# EAGLE design Power-Resistor-Breakout-3W-v001 (EAGLE 6.2)
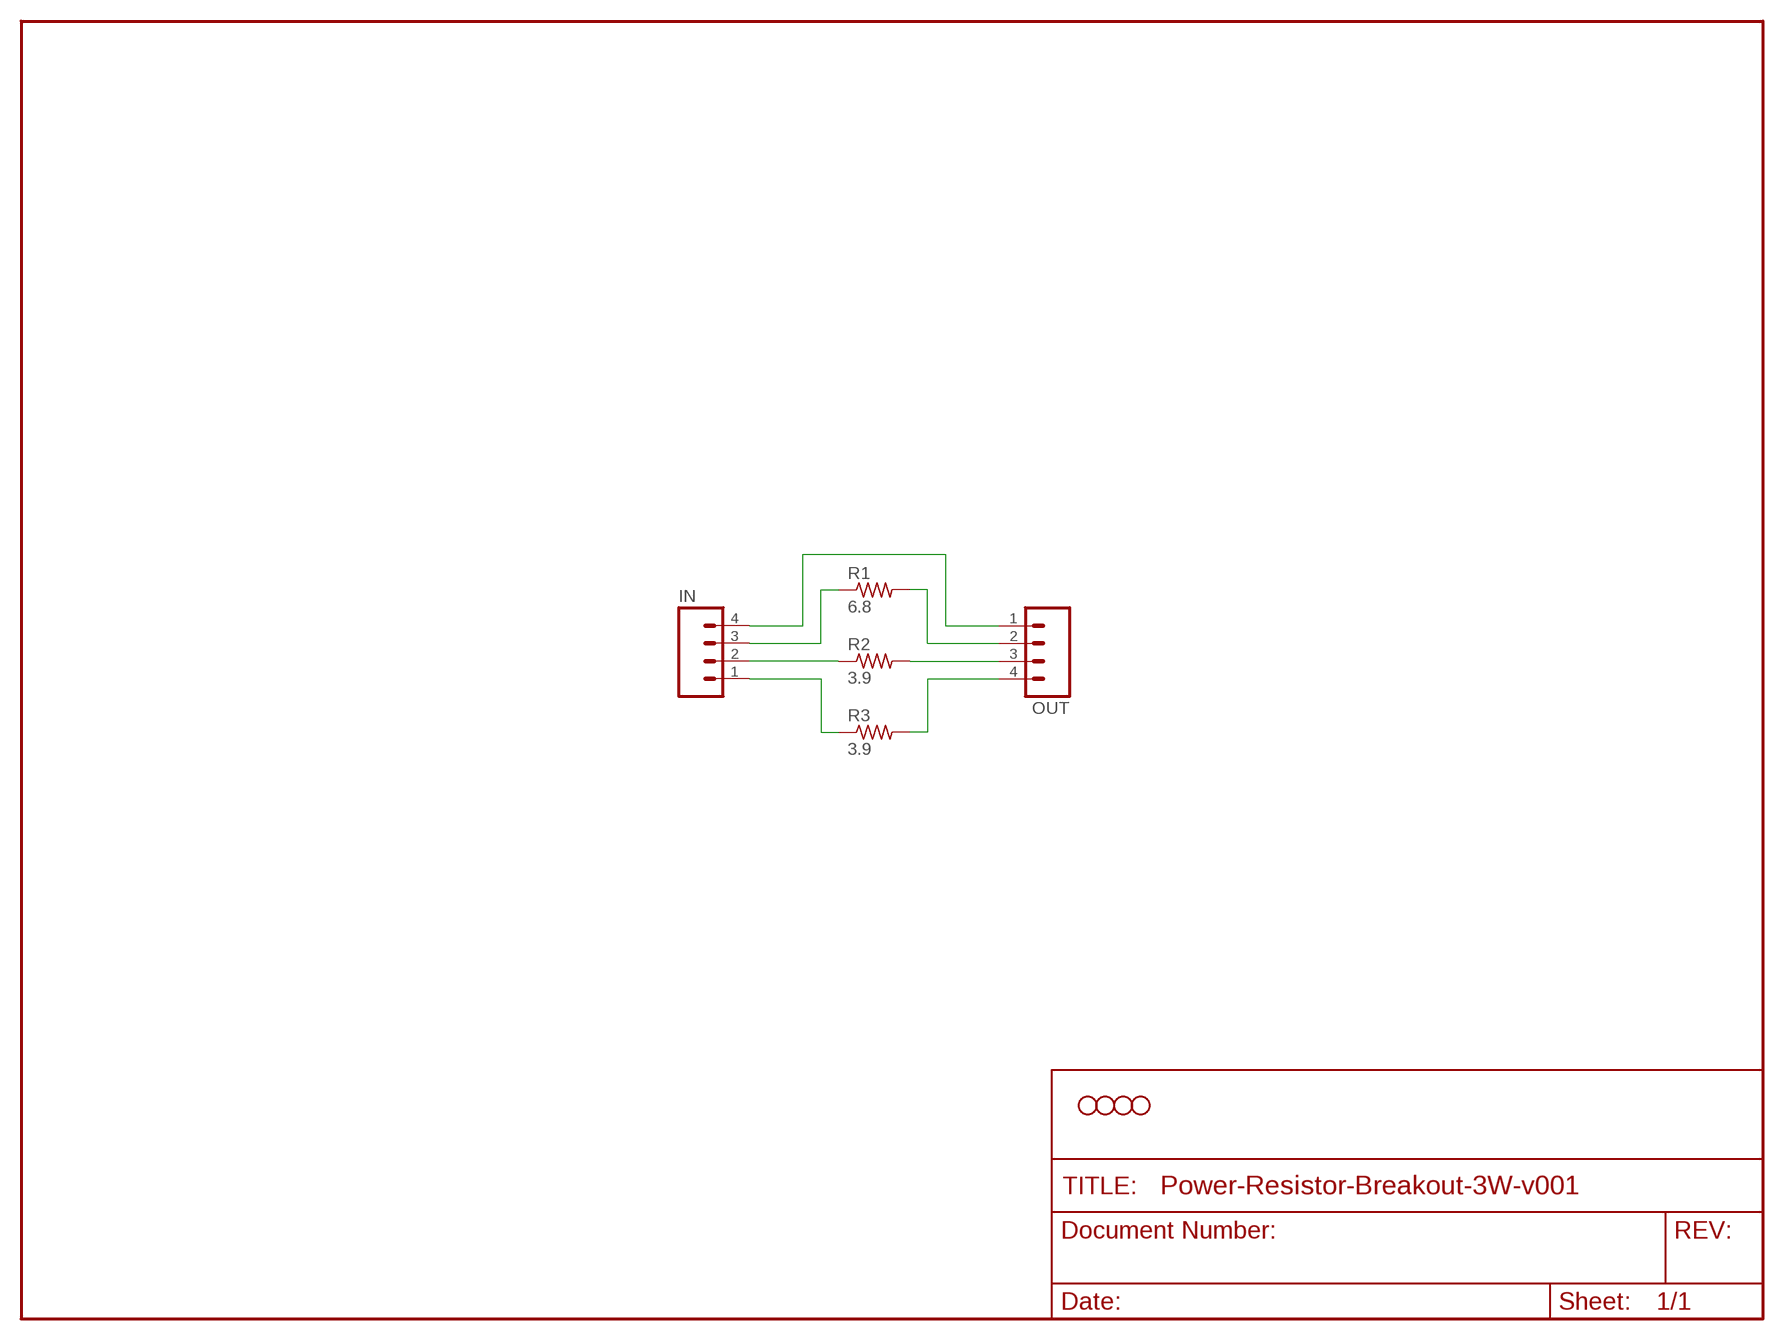
[diagram p0: schematic, sheet 1]

## Parts
IN  M04PTH  [1X04]
JP1  STAND-OFF  [STAND-OFF]
JP2  STAND-OFF  [STAND-OFF]
JP3  STAND-OFF  [STAND-OFF]
JP4  STAND-OFF  [STAND-OFF]
OUT  M04PTH  [1X04]
R1  6.8  R-US_0411/15  [0411/15]
R2  3.9  R-US_0411/15  [0411/15]
R3  3.9  R-US_0411/15  [0411/15]

## Nets
N$1: IN.2 R2.1
N$2: OUT.3 R2.2
N$3: IN.3 R1.1
N$4: IN.1 R3.1
N$5: OUT.4 R3.2
N$6: OUT.2 R1.2
N$7: IN.4 OUT.1

## Library data of the parts
IN OUT = SparkFun:M04: Header 4 Standard 4-pin 0.1" header. Use with straight break away headers (SKU : PRT-00116), right angle break away headers (PRT-00553), swiss pins (PRT-00743), machine pins (PRT-00117), and female headers (PRT-00115). Molex polarized connector foot print use with SKU : PRT-08231 with associated crimp pins and housings. 1MM SMD Version SKU: PRT-10208
JP1-JP4 = SparkFun:STAND-OFF: Stand Off This is the mechanical footprint for a #4 phillips button head screw. Use the keepout ring to avoid running the screw head into surrounding components. SKU : PRT-00447
R1-R3 = resistor:R-US_: RESISTOR, American symbol

## Board
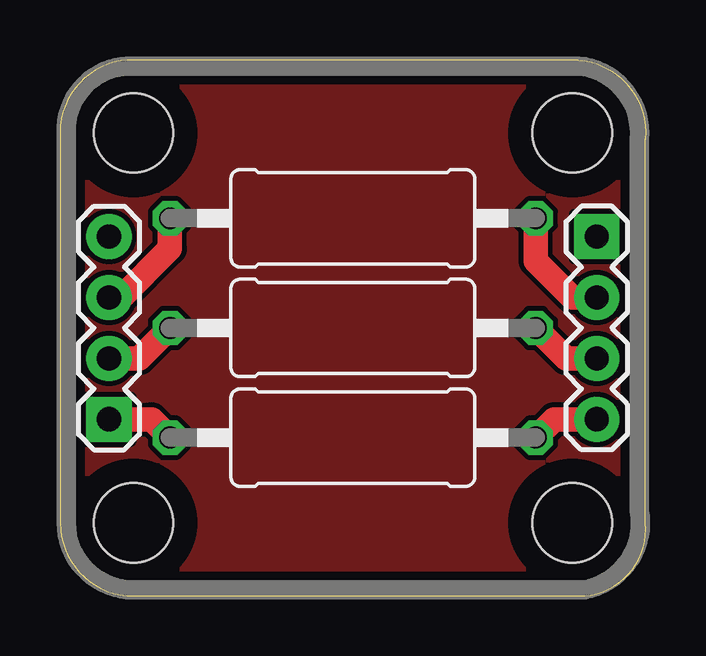
[diagram p1: board, top side]
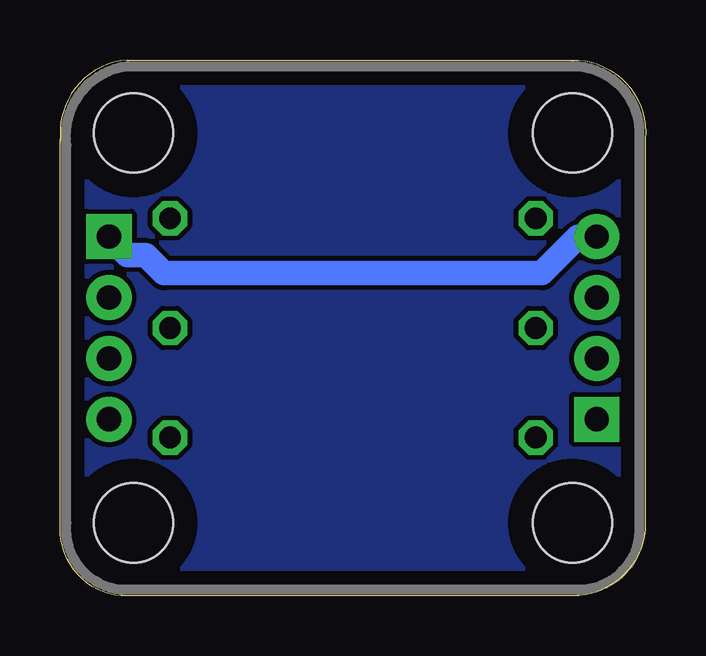
[diagram p2: board, bottom side, seen from below]

Size 24.41 x 22.35 mm. Coordinates in mm from the lower left corner, seen from the top.
Outline: 3.06,0 21.85,0 arc90 24.39,3.05 24.39,19.05 arc90 21.6,22.35 2.8,22.35 arc90 0.01,19.05 0.01,3.05 arc90 3.06,0
Copper layers (1*16): Top 0.035mm / dielectric 1.5mm / Bottom 0.035mm
Design rules "default": minimum track width 10mil, minimum drill 24mil, track to track 8mil, track to pad 8mil, pad to pad 8mil, via to via 8mil, smd to smd 8mil, copper to edge 40mil, drill to drill 8mil, minimum pad ring 10mil, minimum via ring 8mil, stop-mask expansion 4mil, vias tented up to drill 0mil, thermal gap 10mil

### Footprints (pad centres in the part's own frame; a part is rotated, then mirrored left to right if it is on the bottom)
1X04 = drill 1.016 pad 1.88 square: 1 0,0 | drill 1.016 pad 1.88: 2 2.54,0; 3 5.08,0; 4 7.62,0
STAND-OFF = hole 3.302: 0,0
0411/15 = drill 0.914 octagon: 1 -7.62,0; 2 7.62,0

### Placement (x,y rotation side)
IN  2.04,7.37 90 top
JP1  3.06,3.05 0 top
JP2  3.06,19.3 0 top
JP3  21.35,3.05 0 top
JP4  21.35,19.3 0 top
OUT  22.36,14.99 270 top
R1  12.2,15.75 0 top
R2  12.2,11.18 0 top
R3  12.2,6.6 0 top

### Tracks (layer width: path | path; a pad name or v marks a point on that pad's centre or on a via)
GND
  pour Top: 3.06,-0.25 21.85,-0.25 arc90 24.65,3.3 24.65,19.3 arc90 21.6,22.61 3.06,22.61 arc90 -0.24,19.05 -0.24,3.05 arc90
  pour Bottom: 3.06,-0.25 21.85,-0.25 arc90 24.65,3.3 24.65,19.3 arc90 21.6,22.61 3.06,22.61 arc90 -0.24,19.05 -0.24,3.05 arc90
N$1
  Top 1.016: IN.2 3.31,9.91 R2.1
N$2
  Top 1.016: OUT.3 21.09,9.91 R2.2
N$3
  Top 1.016: IN.3 2.55,12.45 4.58,14.48 R1.1
N$4
  Top 1.016: IN.1 3.82,7.37 R3.1
N$5
  Top 1.016: OUT.4 20.58,7.37 R3.2
N$6
  Top 1.016: OUT.2 21.35,12.45 19.82,13.97 R1.2
N$7
  Bottom 1.016: IN.4 2.8,14.99 4.33,13.46 20.08,13.46 20.84,14.22 21.6,14.22 OUT.1

### Text on the board
tDocu: R1 | RED | R2 | GREEN | R3 | BLUE
bDocu: LUMIBOARD | POWER RESISTOR BOARD